# EAGLE design Boost-NEW (EAGLE 9.6.2)
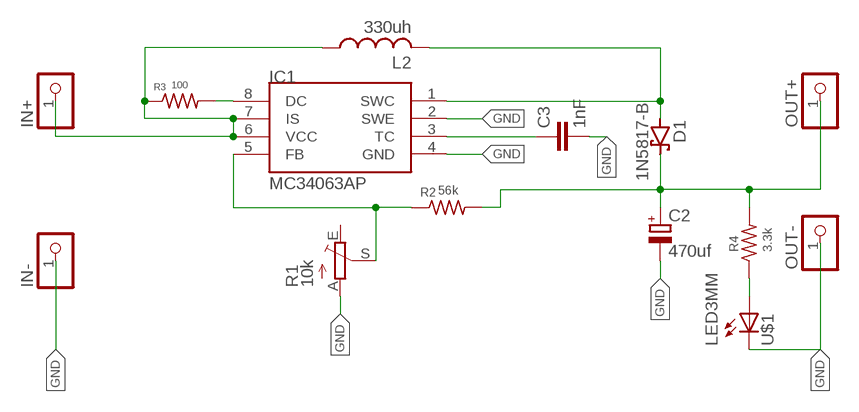
[diagram p0: schematic, sheet 1]

## Parts
C2  470uf  CAP_POL  [E3,5-8]
C3  1nF  CAPACITOR  [C025-025X050]
D1  1N5817-B  [DO41-7.6]
IC1  MC34063AP  [DIL08]
IN+  PINHD-1X1  [1X01]
IN-  PINHD-1X1  [1X01]
L2  330uh  L-USWE-TPC  [POWER-CHOKE_WE-TPC]
OUT+  PINHD-1X1  [1X01]
OUT-  PINHD-1X1  [1X01]
R1  10k  TRIM_EU-CA6V  [CA6V]
R2  56k  RES-7  [0204/7]
R3  100  RES-7  [0204/7]
R4  3.3k  RES-7  [0204/7]
U$1  LED3MM  [LED3MM]

## Nets
GND: C2.- C3.2 IC1.2(SWE) IC1.4(GND) IN-.1 OUT-.1 R1.A U$1.K(C)
IN: C2.+ D1.C OUT+.1 R2.2 R4.2
N$1: IC1.6(VCC) IC1.7(IS) IN+.1 L2.1 R3.1
N$3: R4.1 U$1.A
N$5: D1.A IC1.1(SWC) L2.2
N$6: IC1.5(FB) R1.S R2.1
N$7: C3.1 IC1.3(TC)
N$10: IC1.8(DC) R3.2
Unconnected: R1.E

## Library data of the parts
C2 = MIA_LIBRARY-2-2-2:CAP_POL; SPICEPREFIX: C
C3 = MIA_LIBRARY-2-2-2:CAPACITOR; SPICEPREFIX: C
D1 = diode:1N581*: 1.0A SCHOTTKY BARRIER RECTIFIER Source: http://www.diodes.com/datasheets/ds23001.pdf; SPICEPREFIX: D
IC1 = MIA_LIBRARY-2-2-2:MC34063; SPICEPREFIX: X
IN+ IN- OUT+ OUT- = MIA_LIBRARY-2-2-2:PINHD-1X1: PIN HEADER; SPICEPREFIX: X
L2 = rcl:L-US: INDUCTOR, American symbol; SPICEPREFIX: L
R1 = MIA_LIBRARY-2-2-2:TRIM_EU-: POTENTIOMETER; SPICEPREFIX: J
R2-R4 = MIA_LIBRARY-2-2-2:RES-7; SPICEPREFIX: R
U$1 = MIA_LIBRARY-2-2-2:LED3MM; SPICEPREFIX: B

## Board
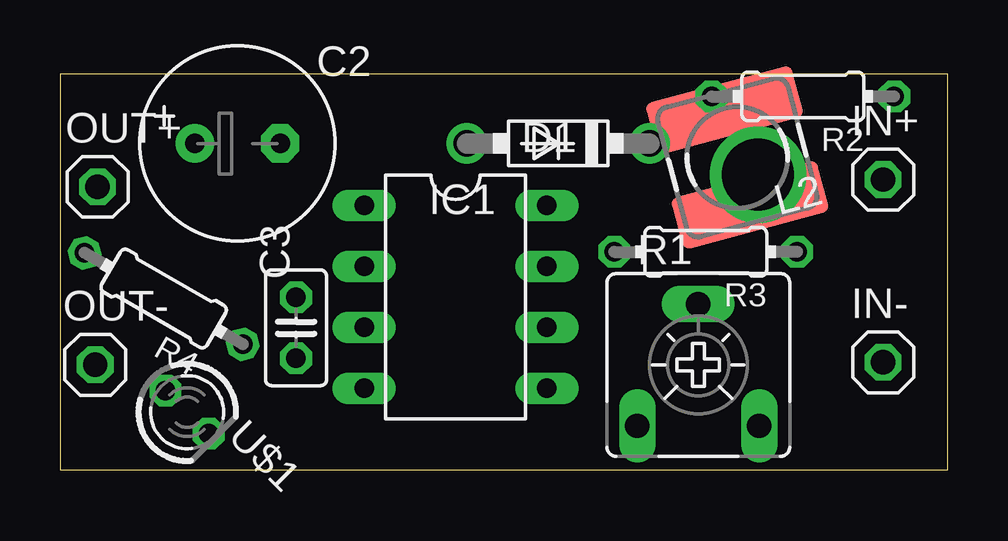
[diagram p1: board, top side]
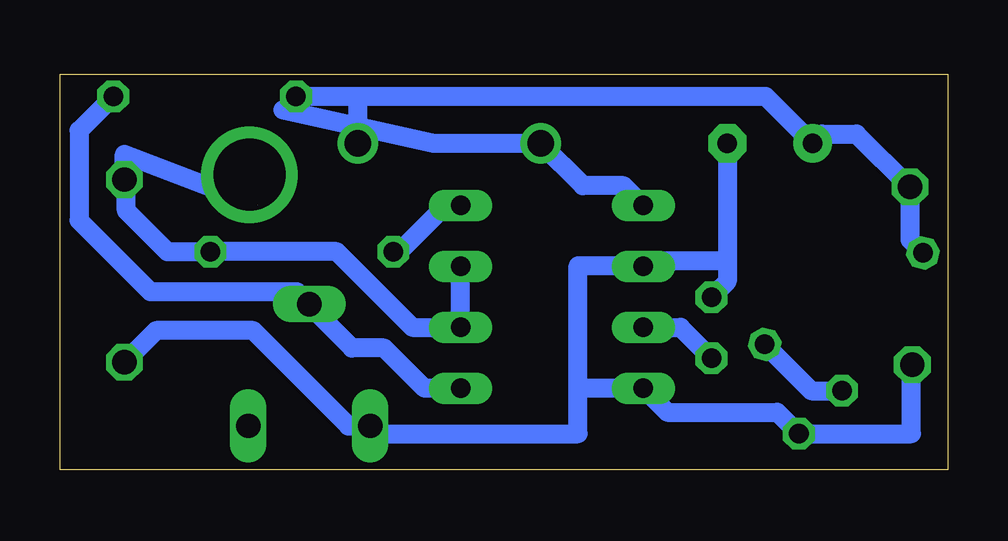
[diagram p2: board, bottom side, seen from below]

Size 37 x 16.5 mm. Coordinates in mm from the lower left corner, seen from the top.
Outline: 0,0 37,0 37,16.5 0,16.5 0,0
Copper layers (1*16): Top 0.035mm / dielectric 1.5mm / Bottom 0.035mm
Design rules "default *": minimum track width 0.1mm, minimum drill 0.35mm, track to track 0.6mm, track to pad 0.6mm, pad to pad 0.6mm, via to via 0.6mm, smd to smd 6mil, copper to edge 0.2mm, drill to drill 0.2mm, minimum pad ring 10mil, minimum via ring 8mil, stop-mask expansion 4mil, vias tented up to drill 0mil, thermal gap 10mil

### Footprints (pad centres in the part's own frame; a part is rotated, then mirrored left to right if it is on the bottom)
E3,5-8 = drill 0.813 pad 1.6: + -1.778,0 | drill 0.813 pad 1.6 octagon: - 1.778,0
C025-025X050 = drill 0.813 octagon: 1 -1.27,0; 2 1.27,0
DO41-7.6 = drill 1.1 pad 1.7: A 3.81,0; C -3.81,0
DIL08 = drill 0.813 long: 1 -3.81,-3.81; 2 -1.27,-3.81; 3 1.27,-3.81; 4 3.81,-3.81; 5 3.81,3.81; 6 1.27,3.81; 7 -1.27,3.81; 8 -3.81,3.81
1X01 = drill 1.016 octagon: 1 0,0
POWER-CHOKE_WE-TPC = smd 6.3 x 2.2: 1 0,2.05; 2 0,-2.05
CA6V = drill 1.016 long: A -2.54,-2.54; E 2.54,-2.54; S 0,2.54
0204/7 = drill 0.813 octagon: 1 -3.81,0; 2 3.81,0
LED3MM = drill 0.813 octagon: A -1.27,0; K 1.27,0

### Placement (x,y rotation side)
C2  7.4,13.61 0 top
C3  9.84,5.92 90 top
D1  20.77,13.61 180 top
IC1  16.49,7.21 270 top
IN+  34.32,12.1 0 top
IN-  34.32,4.48 0 top
L2  28.24,13.02 195 top
OUT+  1.57,11.8 0 top
OUT-  1.47,4.38 0 top
R1  26.61,4.37 0 top
R2  30.97,15.57 180 top
R3  26.92,9.09 180 top
R4  4.32,7.14 150 top
U$1  5.3,2.4 315 top

### Tracks (layer width: path | path; a pad name or v marks a point on that pad's centre or on a via)
GND
  Bottom 0.8: 15.4,3.4 15.4,8.51 12.71,8.51 | 15.4,3.4 IC1.4 11.68,2.4 7.1,2.4 U$1.K 1.5,1.5 1.5,4.35 OUT-.1 | IN-.1 33,5.8 28.94,5.8 24.97,1.83 R1.A 23.74,1.5 15.4,1.5 15.4,3.4 | C3.2 9.18,7.85 9.18,8.7 | 12.71,8.51 IC1.2 | C2.- 9.18,8.7 | 9.18,8.7 12.52,8.7 12.71,8.51
IN
  Bottom 0.8: 24.6,15.57 7.58,15.57 C2.+ 5.23,14 3.8,14 1.6,11.8 OUT+.1 1.57,9.59 R4.2 | 24.6,15.57 R2.2 | D1.C 24.58,15.55 24.6,15.57
N$1  (1 unrouted)
  Bottom 0.8: L2.1 34.32,13.16 IN+.1 34.23,12.01 34.23,10.8 32.52,9.09 R3.1 25.47,9.1 22.31,5.94 IC1.6 IC1.7
N$2  (via drill 3 pad 4)
  other vias: 29.1,12.3
N$3
  Bottom 0.8: R4.1 5.69,3.3 U$1.A
N$5  (1 unrouted)
  Bottom 0.8: IC1.1 13.51,11.85 15.2,11.85 D1.A 21.42,13.61 L2.2
N$6
  Bottom 0.8: R2.1 36.2,14.15 36.2,10.4 33.23,7.43 27.13,7.43 R1.S 26.61,6.86 24.83,5.08 23.48,5.08 21.8,3.4 IC1.5
N$7
  Bottom 0.8: IC1.3 11.13,5.94 C3.1
N$10
  Bottom 0.8: R3.2 22.86,9.09 20.93,11.02 IC1.8